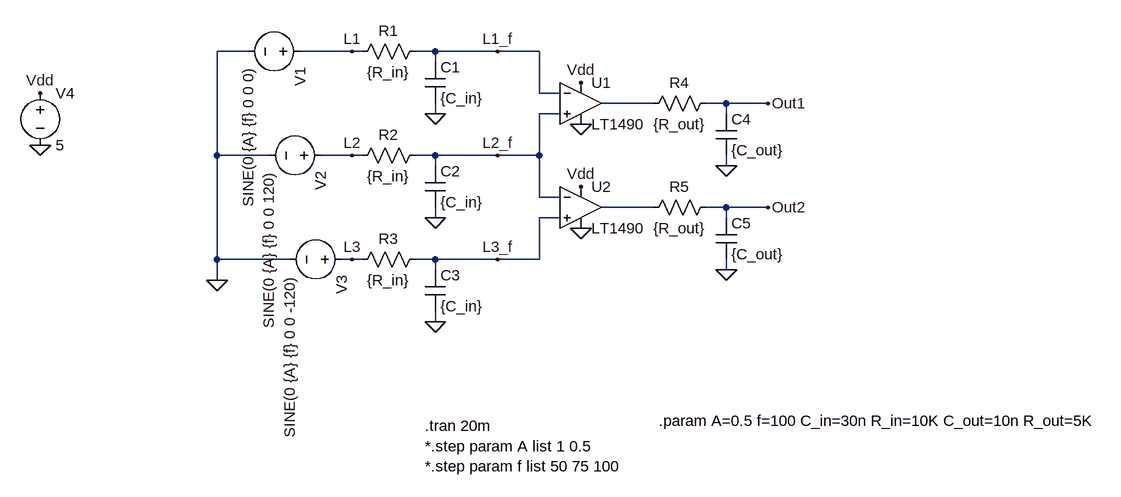
[diagram p0: schematic Draft4.asc]
Draft4.asc, the LTspice schematic file:
Version 4
SHEET 1 1236 760
WIRE -144 112 -192 112
WIRE 16 112 -64 112
WIRE 32 112 16 112
WIRE 144 112 112 112
WIRE 240 112 144 112
WIRE 304 112 240 112
WIRE 144 128 144 112
WIRE 304 176 304 112
WIRE 336 176 304 176
WIRE 480 192 400 192
WIRE 592 192 560 192
WIRE 656 192 592 192
WIRE 144 208 144 192
WIRE 336 208 304 208
WIRE 592 208 592 192
WIRE -192 272 -192 112
WIRE -112 272 -192 272
WIRE 16 272 -32 272
WIRE 32 272 16 272
WIRE 144 272 112 272
WIRE 240 272 144 272
WIRE 304 272 304 208
WIRE 304 272 240 272
WIRE 144 288 144 272
WIRE 592 288 592 272
WIRE 304 336 304 272
WIRE 336 336 304 336
WIRE 480 352 400 352
WIRE 592 352 560 352
WIRE 656 352 592 352
WIRE 144 368 144 352
WIRE 336 368 304 368
WIRE 592 368 592 352
WIRE -192 432 -192 272
WIRE -80 432 -192 432
WIRE 16 432 0 432
WIRE 32 432 16 432
WIRE 144 432 112 432
WIRE 240 432 144 432
WIRE 304 432 304 368
WIRE 304 432 240 432
WIRE 144 448 144 432
WIRE 592 448 592 432
WIRE -192 464 -192 432
WIRE 144 528 144 512
FLAG -192 464 0
FLAG 368 224 0
FLAG 368 160 Vdd
FLAG -464 176 Vdd
FLAG -464 256 0
FLAG 368 384 0
FLAG 368 320 Vdd
FLAG 656 192 Out1
FLAG 656 352 Out2
FLAG 16 112 L1
FLAG 16 272 L2
FLAG 16 432 L3
FLAG 144 208 0
FLAG 144 368 0
FLAG 144 528 0
FLAG 240 112 L1_f
FLAG 240 272 L2_f
FLAG 240 432 L3_f
FLAG 592 288 0
FLAG 592 448 0
SYMBOL voltage -48 112 R90
WINDOW 123 0 0 Left 0
WINDOW 39 0 0 Left 0
SYMATTR InstName V1
SYMATTR Value SINE(0 {A} {f} 0 0 0)
SYMBOL voltage -16 272 R90
WINDOW 123 0 0 Left 0
WINDOW 39 0 0 Left 0
SYMATTR InstName V2
SYMATTR Value SINE(0 {A} {f} 0 0 120)
SYMBOL voltage -464 160 R0
WINDOW 123 0 0 Left 0
WINDOW 39 0 0 Left 0
SYMATTR InstName V4
SYMATTR Value 5
SYMBOL Opamps\\LT1490 368 128 R0
SYMATTR InstName U1
SYMBOL voltage 16 432 R90
WINDOW 123 0 0 Left 0
WINDOW 39 0 0 Left 0
SYMATTR InstName V3
SYMATTR Value SINE(0 {A} {f} 0 0 -120)
SYMBOL Opamps\\LT1490 368 288 R0
SYMATTR InstName U2
SYMBOL res 128 96 R90
WINDOW 0 0 56 VBottom 2
WINDOW 3 32 56 VTop 2
SYMATTR InstName R1
SYMATTR Value {R_in}
SYMBOL res 128 256 R90
WINDOW 0 0 56 VBottom 2
WINDOW 3 32 56 VTop 2
SYMATTR InstName R2
SYMATTR Value {R_in}
SYMBOL res 128 416 R90
WINDOW 0 0 56 VBottom 2
WINDOW 3 32 56 VTop 2
SYMATTR InstName R3
SYMATTR Value {R_in}
SYMBOL cap 128 128 R0
SYMATTR InstName C1
SYMATTR Value {C_in}
SYMBOL cap 128 288 R0
SYMATTR InstName C2
SYMATTR Value {C_in}
SYMBOL cap 128 448 R0
SYMATTR InstName C3
SYMATTR Value {C_in}
SYMBOL res 576 176 R90
WINDOW 0 0 56 VBottom 2
WINDOW 3 32 56 VTop 2
SYMATTR InstName R4
SYMATTR Value {R_out}
SYMBOL cap 576 208 R0
SYMATTR InstName C4
SYMATTR Value {C_out}
SYMBOL res 576 336 R90
WINDOW 0 0 56 VBottom 2
WINDOW 3 32 56 VTop 2
SYMATTR InstName R5
SYMATTR Value {R_out}
SYMBOL cap 576 368 R0
SYMATTR InstName C5
SYMATTR Value {C_out}
TEXT 128 688 Left 2 !.tran 20m\n*.step param A list 1 0.5\n*.step param f list 50 75 100
TEXT 488 680 Left 2 !.param A=0.5 f=100 C_in=30n R_in=10K C_out=10n R_out=5K

The netlist it stands for:
* Draft4.asc
V1 L1 0 SINE(0 {A} {f} 0 0 0)
V2 L2 0 SINE(0 {A} {f} 0 0 120)
V4 Vdd 0 5
XU1 L2_f L1_f Vdd 0 N001 LT1490  ; pins In+ In- V+ V- OUT
V3 L3 0 SINE(0 {A} {f} 0 0 -120)
XU2 L3_f L2_f Vdd 0 N002 LT1490  ; pins In+ In- V+ V- OUT
R1 L1_f L1 {R_in}
R2 L2_f L2 {R_in}
R3 L3_f L3 {R_in}
C1 L1_f 0 {C_in}
C2 L2_f 0 {C_in}
C3 L3_f 0 {C_in}
R4 Out1 N001 {R_out}
C4 Out1 0 {C_out}
R5 Out2 N002 {R_out}
C5 Out2 0 {C_out}
.tran 20m
*.step param A list 1 0.5
*.step param f list 50 75 100
.param A=0.5 f=100 C_in=30n R_in=10K C_out=10n R_out=5K
.backanno
.end